# Altium schematic sheet COMBINED_Schematic.SchDoc
size C; SheetNumber: 1; SheetTotal: 1
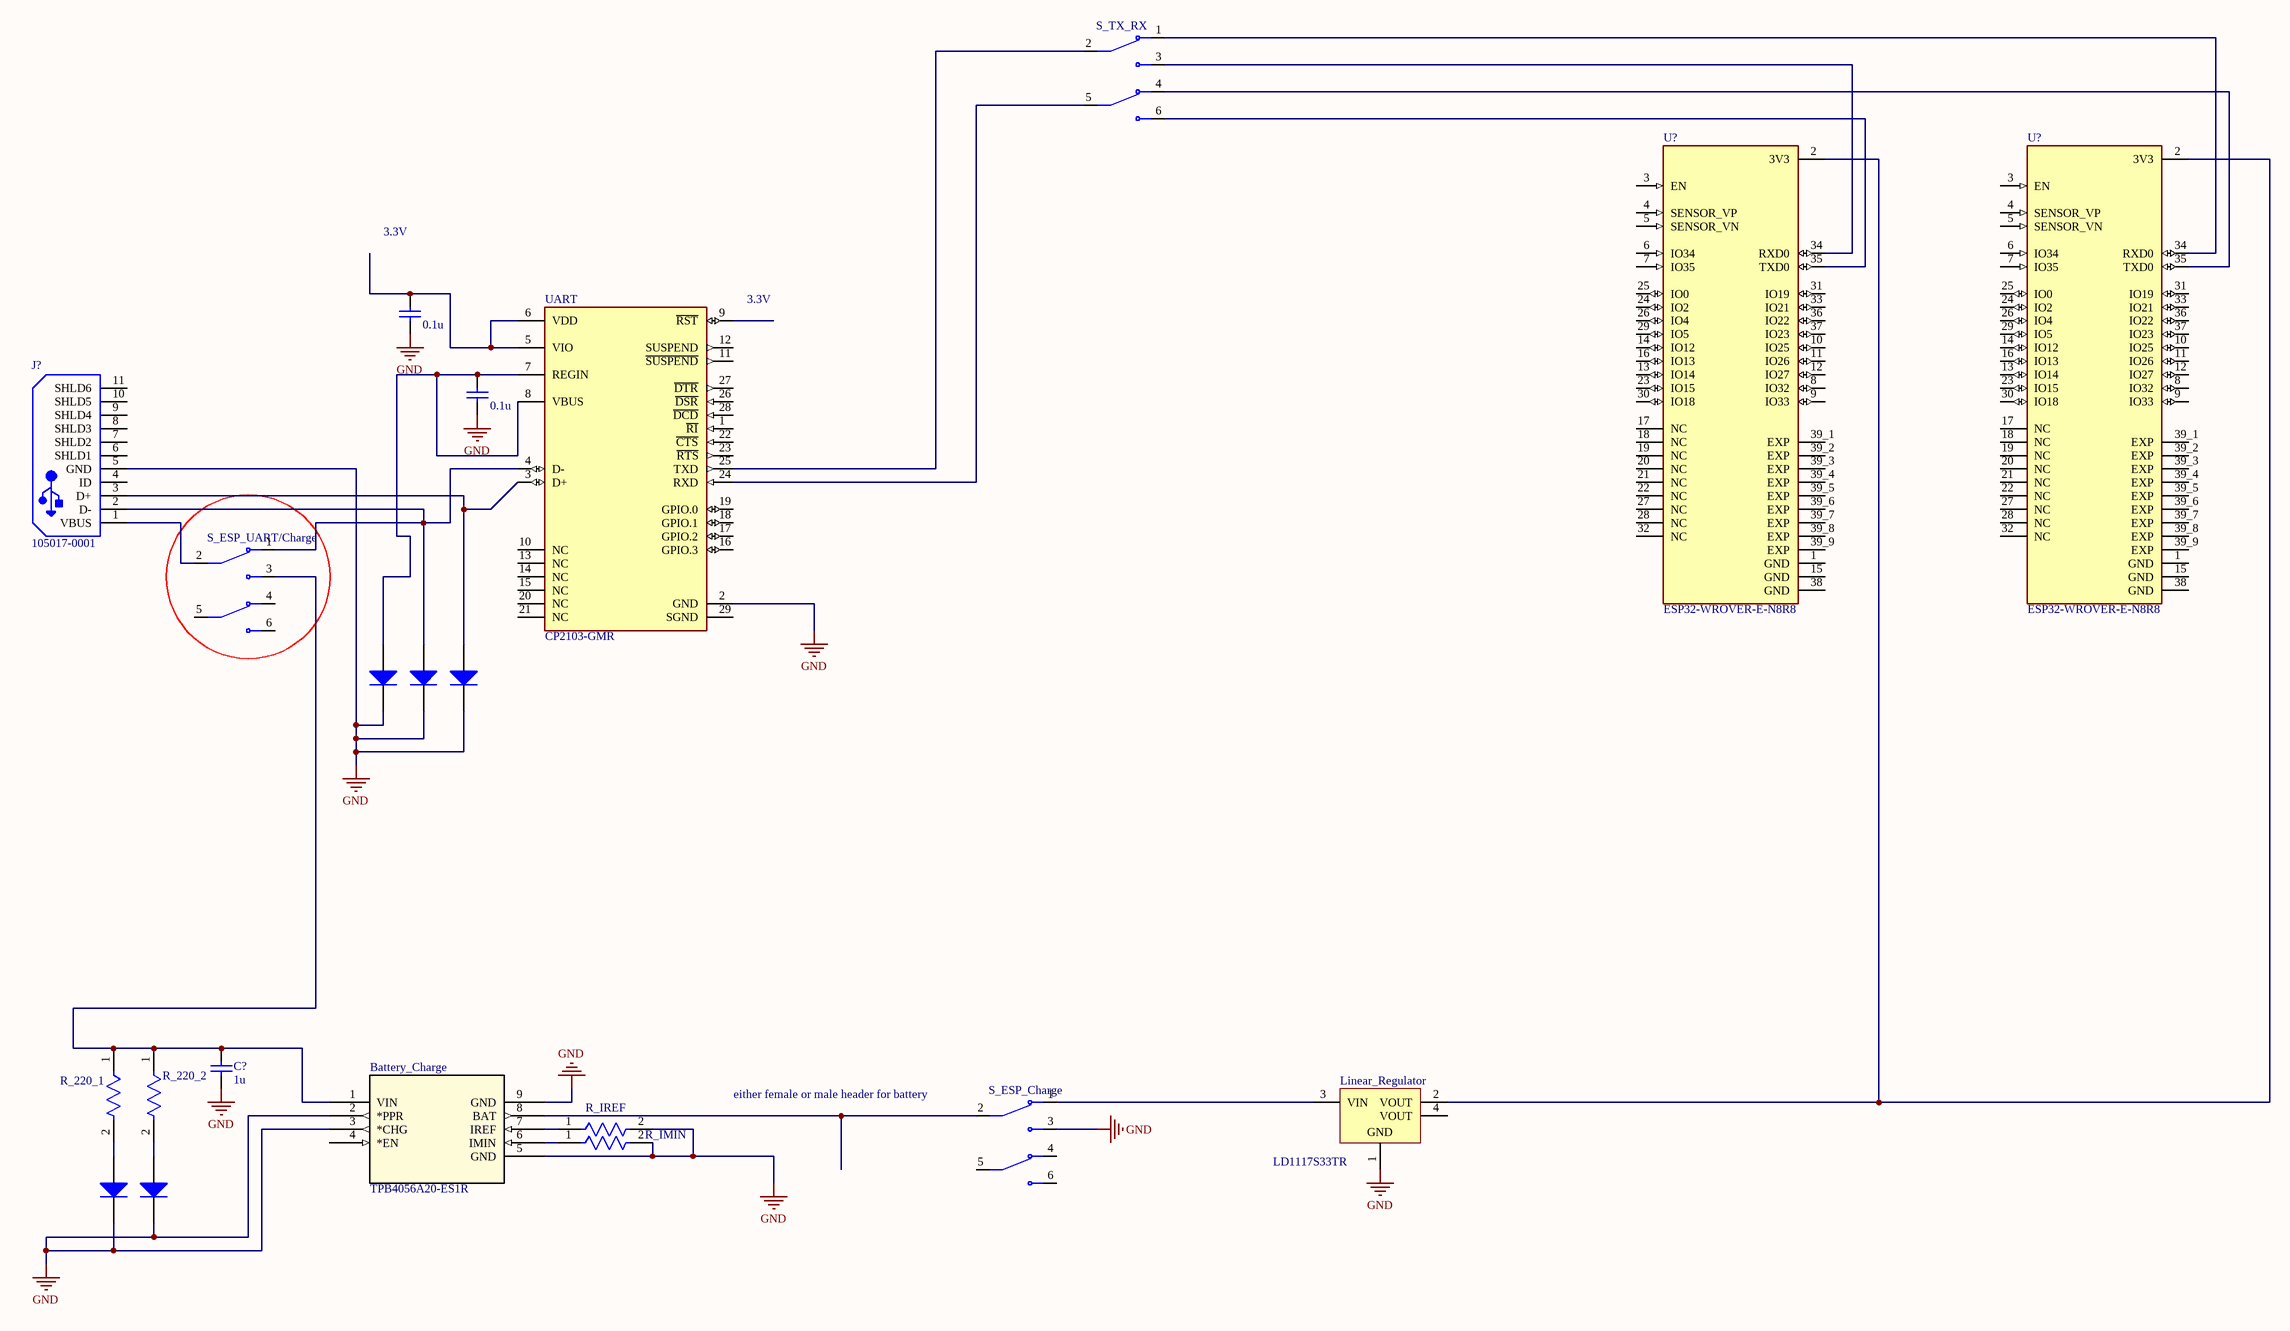
[diagram p0: COMBINED_Schematic.SchDoc]

## Parts
(Parts that share a designator on the sheet are numbered #1, #2 ... from top to bottom, then left to right.)
Battery_Charge  TPB4056A20-ES1R  [ESOP-8_TPK]
C?  value 1u  (hidden comment: Capacitor)
C_Generic_?#1  value 0.1u  (hidden comment: Capacitor)
C_Generic_?#2  value 0.1u  (hidden comment: Capacitor)
D_Generic_?#1  Diode  (value not drawn)
D_Generic_?#2  Diode  (value not drawn)
D_Generic_?#3  Diode  (value not drawn)
D_Generic_?#4  Diode  (value not drawn)
D_Generic_?#5  Diode  (value not drawn)
J?  105017-0001  [USB-MICRO-B_V]
Linear_Regulator  LD1117S33TR  [SOT-223_L]
R_220_1  CRCW0603220RFKEA  [FP-CRCW0603-e3-MFG]  (value not drawn)
R_220_2  CRCW0603220RFKEA  [FP-CRCW0603-e3-MFG]  (value not drawn)
R_IMIN  AC0603FR-07100KL  [FP-AC0603-MFG]  (value not drawn)
R_IREF  CRCW06031K50FKEA  [FP-CRCW0603-e3-IPC_A]  (value not drawn)
S_ESP_Charge  SLW-913535-2A-SMT  [SW_SLW-913535-2A-SMT]  (value not drawn)
S_ESP_UART/Charge  SLW-913535-2A-SMT  [SW_SLW-913535-2A-SMT]  (value not drawn)
S_TX_RX  SLW-913535-2A-SMT  [SW_SLW-913535-2A-SMT]  (value not drawn)
U?#1  ESP32-WROVER-E-N8R8  [XCVR_ESP32-WROVER-E-N8R8]
U?#2  ESP32-WROVER-E-N8R8  [XCVR_ESP32-WROVER-E-N8R8]
UART  CP2103-GMR  [FP-CP2103-GMR-MFG]

## Nets
GND: Battery_Charge.2(*PPR) Battery_Charge.3(*CHG) Battery_Charge.5(GND) Battery_Charge.9(GND) C?.1 C_Generic_?#1.2 C_Generic_?#2.2 D_Generic_?#1.2(K) D_Generic_?#2.2(K) D_Generic_?#3.2(K) D_Generic_?#4.2(K) D_Generic_?#5.2(K) J?.5(GND) Linear_Regulator.1(GND) R_IMIN.2 R_IREF.2 S_ESP_Charge.3 UART.2(GND)
NetBattery_Charge_1: Battery_Charge.1(VIN) C?.2 R_220_1.1 R_220_2.1 S_ESP_UART/Charge.3
NetBattery_Charge_6: Battery_Charge.6(IMIN) R_IMIN.1
NetBattery_Charge_7: Battery_Charge.7(IREF) R_IREF.1
NetBattery_Charge_8: Battery_Charge.8(BAT) S_ESP_Charge.2
NetC_Generic_?#1_1: C_Generic_?#1.1 UART.5(VIO) UART.6(VDD)
NetC_Generic_?#2_1: C_Generic_?#2.1 D_Generic_?#1.1(A) UART.7(REGIN) UART.8(VBUS)
NetD_Generic_?#2_1: D_Generic_?#2.1(A) J?.2(D-) S_ESP_UART/Charge.1 UART.4(D-)
NetD_Generic_?#3_1: D_Generic_?#3.1(A) J?.3(D+) UART.3(D+)
NetD_Generic_?#4_1: D_Generic_?#4.1(A) R_220_1.2
NetD_Generic_?#5_1: D_Generic_?#5.1(A) R_220_2.2
NetJ?_1: J?.1(VBUS) S_ESP_UART/Charge.2
NetLinear_Regulator_2: Linear_Regulator.2(VOUT) U?#1.2(3V3) U?#2.2(3V3)
NetLinear_Regulator_3: Linear_Regulator.3(VIN) S_ESP_Charge.1
NetS_TX_RX_1: S_TX_RX.1 U?#2.34(RXD0)
NetS_TX_RX_2: S_TX_RX.2 UART.25(TXD)
NetS_TX_RX_3: S_TX_RX.3 U?#1.34(RXD0)
NetS_TX_RX_4: S_TX_RX.4 U?#2.35(TXD0)
NetS_TX_RX_5: S_TX_RX.5 UART.24(RXD)
NetS_TX_RX_6: S_TX_RX.6 U?#1.35(TXD0)

Not connected (* = marked no-connect by the designer): Battery_Charge 4(*EN); J? 4(ID) 6(SHLD1) 7(SHLD2) 8(SHLD3) 9(SHLD4) 10(SHLD5) 11(SHLD6); Linear_Regulator 4(VOUT); S_ESP_Charge 4 5 6; S_ESP_UART/Charge 4 5 6; U?#1 1(GND) 3(EN) 4(SENSOR_VP) 5(SENSOR_VN) 6(IO34) 7(IO35) 8(IO32) 9(IO33) 10(IO25) 11(IO26) 12(IO27) 13(IO14) 14(IO12) 15(GND) 16(IO13) 17(NC) 18(NC) 19(NC) 20(NC) 21(NC) 22(NC) 23(IO15) 24(IO2) 25(IO0) 26(IO4) 27(NC) 28(NC) 29(IO5) 30(IO18) 31(IO19) 32(NC) 33(IO21) 36(IO22) 37(IO23) 38(GND) 39_1(EXP) 39_2(EXP) 39_3(EXP) 39_4(EXP) 39_5(EXP) 39_6(EXP) 39_7(EXP) 39_8(EXP) 39_9(EXP); U?#2 1(GND) 3(EN) 4(SENSOR_VP) 5(SENSOR_VN) 6(IO34) 7(IO35) 8(IO32) 9(IO33) 10(IO25) 11(IO26) 12(IO27) 13(IO14) 14(IO12) 15(GND) 16(IO13) 17(NC) 18(NC) 19(NC) 20(NC) 21(NC) 22(NC) 23(IO15) 24(IO2) 25(IO0) 26(IO4) 27(NC) 28(NC) 29(IO5) 30(IO18) 31(IO19) 32(NC) 33(IO21) 36(IO22) 37(IO23) 38(GND) 39_1(EXP) 39_2(EXP) 39_3(EXP) 39_4(EXP) 39_5(EXP) 39_6(EXP) 39_7(EXP) 39_8(EXP) 39_9(EXP); UART 1(~{RI}) 9(~{RST}) 10(NC) 11(~{SUSPEND}) 12(SUSPEND) 13(NC) 14(NC) 15(NC) 16(GPIO.3) 17(GPIO.2) 18(GPIO.1) 19(GPIO.0) 20(NC) 21(NC) 22(~{CTS}) 23(~{RTS}) 26(~{DSR}) 27(~{DTR}) 28(~{DCD}) 29(SGND)

## Notes on the sheet
- 3.3V
- (near UART) 3.3V
- (near S_ESP_Charge) either female or male header for battery

## Library data of the parts
Battery_Charge = TPB4056A20-ES1R: No Description Available; Mfr_Name: 3Peak; RefDes: RefDes; Type: Type; Supplier 1: Digikey; Supplier Part Number 1: 5503-TPB4056A20-ES1RCT-ND
C? C_Generic_?#1 C_Generic_?#2 = Capacitor: SimulationGenericComponent: True
D_Generic_?#1-D_Generic_?#5 = Diode: AF: 1; BV: 0; BV_MAX: 1e99; EG: 1.11; FC: 0.5; IBV: 0.001; ISR: 1e-14; MJSW: 0.33; NTUN: 30; TNOM: 27; XTI: 3; SimulationGenericComponent: True; CJO: 0; CJP: 0; CTA: 0; CTP: 0; FCS: 0.5; FV_MAX: 1e99; IKF: 0; IKR: 0; JSW: 0; JTUN: 0; JTUNSW: 0; KEG: 1; KF: 0; LEVEL: 1; N: 1; NBV: 1; NR: 1; NS: 1; PHP: 1; RS: 0; TCV: 0; TLEV: 0; TLEVC: 0; TM1: 0; TM2: 0; TPB: 0; TPHP: 0; TRS: 0; TRS2: 0; TT: 0; TTT1: 0; TTT2: 0; VJ: 1; XTITUN: 3; IS: 1e-14
J? = CMP-2000-05827-1: Micro-USB B Receptacle, Right Angle, Bottom Mount, Surface Mount, with Solder Tabs, -30 to 85 degC, 5-Pin USB, RoHS, Tape and Reel; Manufacturer: Molex; Featured Product: Micro-USBConnectorsUSBConnectors; Other Names: WM1399DKR; Package Version: Rev. F, 12/2012; Number of Contacts: 5; Connector Type: USB-microB; Catalog Drawings: 1050170001; 3D Model: 105017-0001.stp; Mating Products: WM17145-ND-CABLEMICROUSBBTOSTDA1.0MWM17147-ND-CABLEMICROUSBBTOSTDA2.0MWM17146-ND-CABLEMICROUSBBTOSTDA1.5M; PCN Assembly/Origin: ResinSupplier21/Oct/2015; Voltage - Max: 30V; Online Catalog: Molex-MicroUSB; Manufacturer URL: http://www.molex.com/; Package Description: 5-Leads USB, Micro B, Body 7.5 x 5 mm, Pitch 0.65 mm; Datasheet URL: http://www.molex.com/elqNow/elqRedir.htm?ref=http://www.molex.com/webdocs/datasheets/pdf/en-us/1050170001_IO_CONNECTORS.pdf; Ingress Protection: -; Datasheet Version: 03/2016; Mounting Type: BoardCutout,SurfaceMount,RightAngle; Circuits: 5; Standard Package: 1; Package Reference: MICRO-B; Package URL: http://www.molex.com/pdm_docs/sd/1050170001_sd.pdf; Category: Connectors,Interconnects; Series: -; RoHS Information: 1050170001CertofCompliance; Features: Shielded,SolderRetention; Family: USB,DVI,HDMIConnectors; Specifications: -; Gender: Receptacle; Packaging: Digi-Reel®; Mounting Technology: SurfaceMount
Linear_Regulator = CMP-0244-00310-1: Fixed Low Drop Positive Voltage Regulator, 3.3V, 4-Pin SOT-223, Tape and Reel; ComponentLink2Description: Datasheet; PackageDescription: 4-Pin SOT-223 Package, 6.5 x 3.5 mm Body, 2.3 mm Pitch, 7 mm Lead Span; PackageVersion: 2010; ComponentLink2URL: http://www.st.com/internet/com/TECHNICAL_RESOURCES/TECHNICAL_LITERATURE/DATASHEET/CD00000544.pdf; PackageReference: SOT-223; DatasheetVersion: 1/11/2011; ComponentLink1Description: Manufacturer URL; ComponentLink1URL: http://www.st.com
R_220_1 R_220_2 = CMP-2000-03085-2: RES Thick Film, 220Ω, 1%, 0.1W, 100ppm/°C, 0603; Power Rating: 100mW; Voltage Rating: 75V; Resistance: 220R; Contact Plating: Tin; Package Quantity: 10; Lead Free: Lead Free; Packaging: Tape and Reel; Max Operating Temperature: 155°C; Case/Package: 0603; Radiation Hardening: No; Height: 0.45mm; Width: 0.033inch; Case Code (Imperial): 0603; Number of Terminations: 2; Tolerance: 1%; Min Operating Temperature: -55°C; Termination: SMD/SMT; Length: 1.55mm; Features: Automotive AEC-Q200; Voltage Rating (DC): 75V; Case Code (Metric): 1608; Composition: Thick Film; Military Standard: Not; Temperature Coefficient: 100ppm/°C; Depth: 0.85mm; Weight: 7.1E-05oz; Max Power Dissipation: 100mW
R_IMIN = CMP-2000-04816-3: RES 100KΩ 1.00% 0.1W 0603; Temperature Coefficient: 100ppm/°C; Voltage Rating: 50V; Max Power Dissipation: 100mW; Tolerance: 1%; Working Voltage: 75V; Resistance: 100kR; Min Operating Temperature: -55°C; Case Code (Imperial): 0603; Width: 0.031inch; Max Operating Temperature: 155°C; Military Standard: Not; Technology: THICK FILM; Ratings: AEC-Q200; Features: Moisture Resistant; Construction: Rectangular; Resistor Type: Thick Film; RoHS Compliant: Yes; Case Code (Metric): 1608; Termination: SMD/SMT; Series: AC; Lead Free: Lead Free; Length: 1.6mm; Depth: 0.8mm; Height: 0.022inch; Power Rating: 100mW; Package Quantity: 1; Packaging: Tape and Reel; Case/Package: 0603; Number of Terminations: 2; Moisture Sensitivity Level: 1
R_IREF = CMP-2000-02995-2: RES Thick Film, 1.5kΩ, 1%, 0.1W, 100ppm/°C, 0603; Working Voltage: 75V; Power Rating: 100mW; Resistance: 1.5kR; Max Operating Temperature: 155°C; Features: Automotive AEC-Q200; Min Operating Temperature: -55°C; Width: 0.033inch; Case/Package: 0603; Voltage Rating (DC): 75V; Termination: SMD/SMT; Mount: Surface Mount; Weight: 7.1E-05oz; Case Code (Metric): 1608; Height: 0.45mm; Voltage Rating: 75V; Length: 1.55mm; Package Quantity: 10; Lead Free: Lead Free; Composition: Thick Film; Packaging: Tape and Reel; Temperature Coefficient: 100ppm/°C; Tolerance: 1%; Military Standard: Not; Case Code (Imperial): 0603; Number of Terminations: 2; Max Power Dissipation: 100mW; Depth: 0.85mm; Contact Plating: Tin
S_ESP_Charge S_ESP_UART/Charge S_TX_RX = CMP-007-000000-2: Switch Slide ON ON DPDT Raised Slide 0.1A 12VDC 10000Cycles Gull Wing SMD Box; Package: None; Availability: Unavailable; Price: None; Source: SLW-913535-2A-SMT.SchLib; Component Type: Standard; MP: SLW-913535-2A-SMT; Value: *; Pin Count: 6; Design Item ID: SLW-913535-2A-SMT
U?#1 U?#2 = CMP-005-000000-2: Multiprotocol Modules SMD Module ESP32-WROVER-E, ESP32-D0WD-V3, 3.3V 64Mbit PSRAM, 8 MB SPI flash, PCB Antenna; MP: ESP32-WROVER-E-N8R8; Availability: Unavailable; Price: None; Component Type: Standard; Package: None; Design Item ID: ESP32-WROVER-E-N8R8; Source: ESP32-WROVER-E-N8R8.SchLib; Value: *; Pin Count: 47
UART = CMP-08107-000005-1: IC CTRLR BRIDGE USB-UART 28MLP; Manufacturer: Silicon Labs; Nominal Supply Current: 20mA; Interface: UART,USB,RS-232,RS-485; Max Supply Voltage: 3.6V; Min Supply Voltage: 1.8V; Standoff Height: 0.03mm; Function: Bridge, USB to UART; ComponentLink2Description: Datasheet; Automotive: No; Device Class L1: Integrated Circuits (ICs); Ambient Temperature Range Low: -55°C; Digikey Description: IC CTRLR BRIDGE USB-UART 28MLP; Temperature Range Low: -40°C; Category: IC; Ambient Temperature Range High: +125°C; Ipc Land Pattern Name: QFN50P500X500X90-28; Device Class L2: Interface ICs; Temperature Range High: +85°C; Mouser Description: I/O Controller Interface IC USB-TO-UART BRIDGE; Octopart: https://octopart.com/cp2103-gmr-silicon+labs-519938; RoHS: TRUE; ComponentLink2URL: https://www.silabs.com/documents/public/data-sheets/CP2103.pdf; Lead Free: Yes; Height: 1mm; Package: 0; Device Class L3: Controllers; Manufacturer Part Number: CP2103-GMR; Temperature: -40°C to +85°C